# EasyEDA schematic SCH_EMG_2025-07-22.json
TITLE: EMG - Eletrônica 3: Amplificadores; REV: 1.0; Date: 2025-05-27; Sheet: 1/1; Drawn By: Lucas Yukio Fukuda Matsumoto; Company: UTFPR
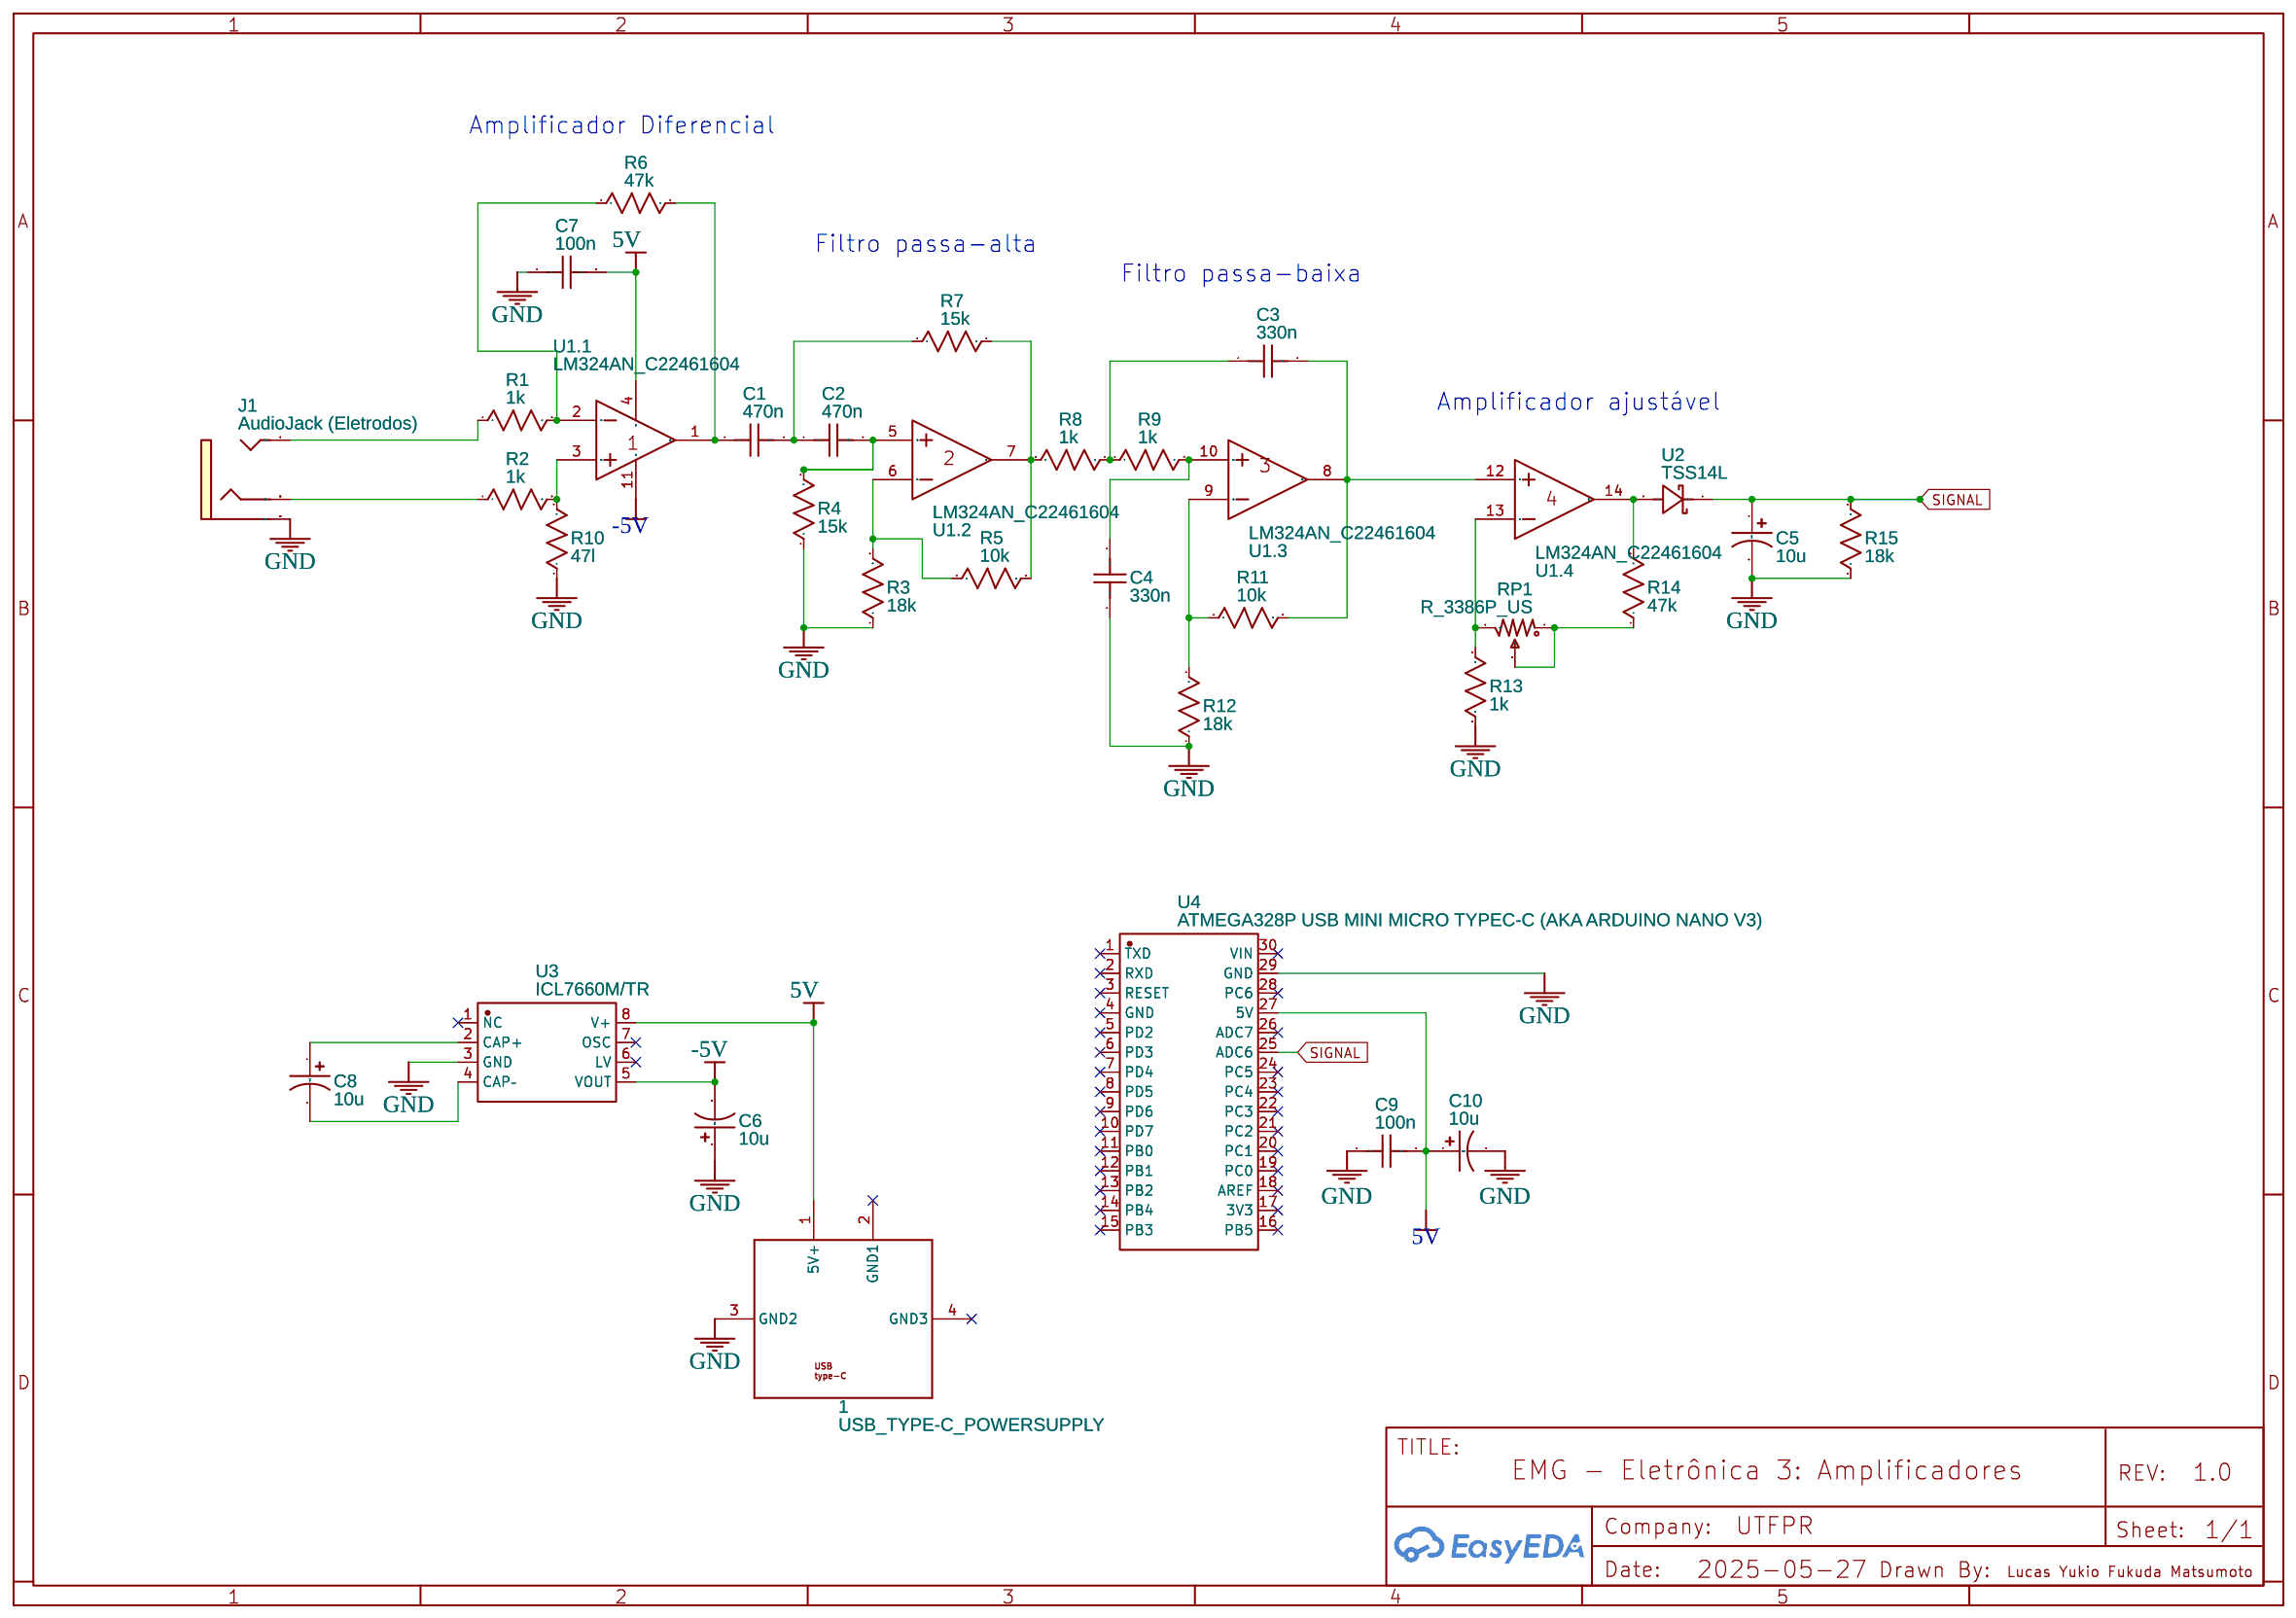
[diagram p0: schematic sheet]

## Parts
1  USB_TYPE-C_POWERSUPPLY  [USB_TYPE-C_POWERSUPPLY]
C1  470n  [C0603]
C2  470n  [C0603]
C3  330n  [C0603]
C4  330n  [C0603]
C5  10u  [CASE-A_3216]
C6  10u  [CASE-A_3216]
C7  100n  [C0603]
C8  10u  [CASE-A_3216]
C9  100n  [C0603]
C10  10u  [CASE-A_3216]
J1  AudioJack (Eletrodos)  [AUDIO-JACK]
R1  1k  [R0603]
R2  1k  [R0603]
R3  18k  [R0603]
R4  15k  [R0603]
R5  10k  [R0603]
R6  47k  [R0603]
R7  15k  [R0603]
R8  1k  [R0603]
R9  1k  [R0603]
R10  47l  [R0603]
R11  10k  [R0603]
R12  18k  [R0603]
R13  1k  [R0603]
R14  47k  [R0603]
R15  18k  [R0603]
RP1  R_3386P_US  [RES-ADJ-TH_3386P]
U1  LM324AN_C22461604  [DIP-14_L19.4-W6.4-P2.54-LS7.6-BL]  (sections 1,2,3,4)
U2  TSS14L  [DO-214AC_L4.3-W2.7-LS5.0-RD]
U3  ICL7660M/TR  [SOP-8_L4.9-W3.9-P1.27-LS6.0-BL]
U4  ATMEGA328P USB MINI MICRO TYPEC-C (AKA ARDUINO NANO V3)  [COMM-TH_L43.2-W17.8-P2.54_ATMEGA328P]

## Library data of the parts
1 = USB_TYPE-C_POWERSUPPLY: Contributor: mzkmtmhr
C1-C4 C7 C9 = C_0603_US: Contributor: LCEDA_Lib
C5 C6 C8 C10 = C_Tan_SMD_A_US: Contributor: LCEDA_Lib
J1 = AudioJack: catid: 20; Contributor: asadog; Manufacturer Part: ?
R1-R15 = R_0603_US: Contributor: LCEDA_Lib
RP1 = R_3386P_US: Supplier: LCSC; Contributor: LCEDA_Lib; value(Ω): 10K
U1 = LM324AN_C22461604: Supplier: LCSC; Supplier Part: C22461604; Manufacturer: HGSEMI(华冠); Manufacturer Part: LM324AN; subpart_no: 1; JLCPCB Part Class: Extended Part
U2 = TSS14L: Supplier: LCSC; Supplier Part: C5161859; Manufacturer: ZHIDE(志得); Contributor: lcsc; JLCPCB Part Class: Extended Part
U3 = ICL7660M/TR: Contributor: LCSC; Supplier: LCSC; Supplier Part: C356724; Manufacturer: HGSEMI(华冠); JLCPCB Part Class: Extended Part
U4 = ATMEGA328P USB MINI MICRO TYPEC-C (AKA ARDUINO NANO V3): Supplier: LCSC; Supplier Part: C9900187880; Manufacturer: null; Manufacturer Part: ATMEGA328P USB Mini Micro Typec-C (aka Arduino Nano V3); JLCPCB Part Class: Extended Part; Contributor: lcsc

## Nets
5V: 1.1(5V+) C7.2 C9.1 C10.1 U1.4(VCC) U3.8(V+) U4.27(5V)
-5V: C6.2 U1.11(GND) U3.5(VOUT)
GND: 1.3(GND2) C4.1 C5.2 C6.1 C7.1 C9.2 C10.2 J1.SLEEVE R3.1 R4.1 R10.1 R12.1 R13.1 R15.1 U3.3(GND) U4.29(GND)
SIGNAL: C5.1 R15.2 U2.1(C) U4.25(ADC6)
Net-(C1-1): C1.1 R6.2 U1.1(1OUT)
Net-(C1-2): C1.2 C2.1 R7.1
Net-(C2-2): C2.2 R4.2 U1.5(2IN+)
Net-(C3-1): C3.1 R8.2 R9.1
Net-(C3-2): C3.2 R11.2 U1.8(3OUT) U1.12(4IN+)
Net-(C4-2): C4.2 R9.2 U1.10(3IN+)
Net-(C8-1): C8.1 U3.2(CAP+)
Net-(C8-2): C8.2 U3.4(CAP–)
Net-(J1-RING): J1.RING R2.1
Net-(J1-TIP): J1.TIP R1.1
Net-(R1-2): R1.2 R6.1 U1.2(1IN-)
Net-(R2-2): R2.2 R10.2 U1.3(1IN+)
Net-(R3-2): R3.2 R5.1 U1.6(2IN-)
Net-(R5-2): R5.2 R7.2 R8.1 U1.7(2OUT)
Net-(R11-1): R11.1 R12.2 U1.9(3IN-)
Net-(R13-2): R13.2 RP1.3 U1.13(4IN-)
Net-(R14-1): R14.1 RP1.1 RP1.2
Net-(R14-2): R14.2 U1.14(4OUT) U2.2(A)

Not connected (* = marked no-connect by the designer): 1 2(GND1)* 4(GND3)*; U3 1(NC)* 6(LV)* 7(OSC)*; U4 1(TXD)* 2(RXD)* 3(RESET)* 4(GND)* 5(PD2)* 6(PD3)* 7(PD4)* 8(PD5)* 9(PD6)* 10(PD7)* 11(PB0)* 12(PB1)* 13(PB2)* 14(PB4)* 15(PB3)* 16(PB5)* 17(3V3)* 18(AREF)* 19(PC0)* 20(PC1)* 21(PC2)* 22(PC3)* 23(PC4)* 24(PC5)* 26(ADC7)* 28(PC6)* 30(VIN)*

## Notes on the sheet
- Amplificador Diferencial
- Filtro passa-alta
- Filtro passa-baixa
- Amplificador ajustável
